# EAGLE schematic emoteino (EAGLE 8.2.1)
PROJECT_AUTHOR: TINKERMAN <xose.perez@gmail.com>; PROJECT_LICENSE: MIT; PROJECT_NAME: MOTEINO EMON SHIELD; PROJECT_VERSION: 0.2.20161214
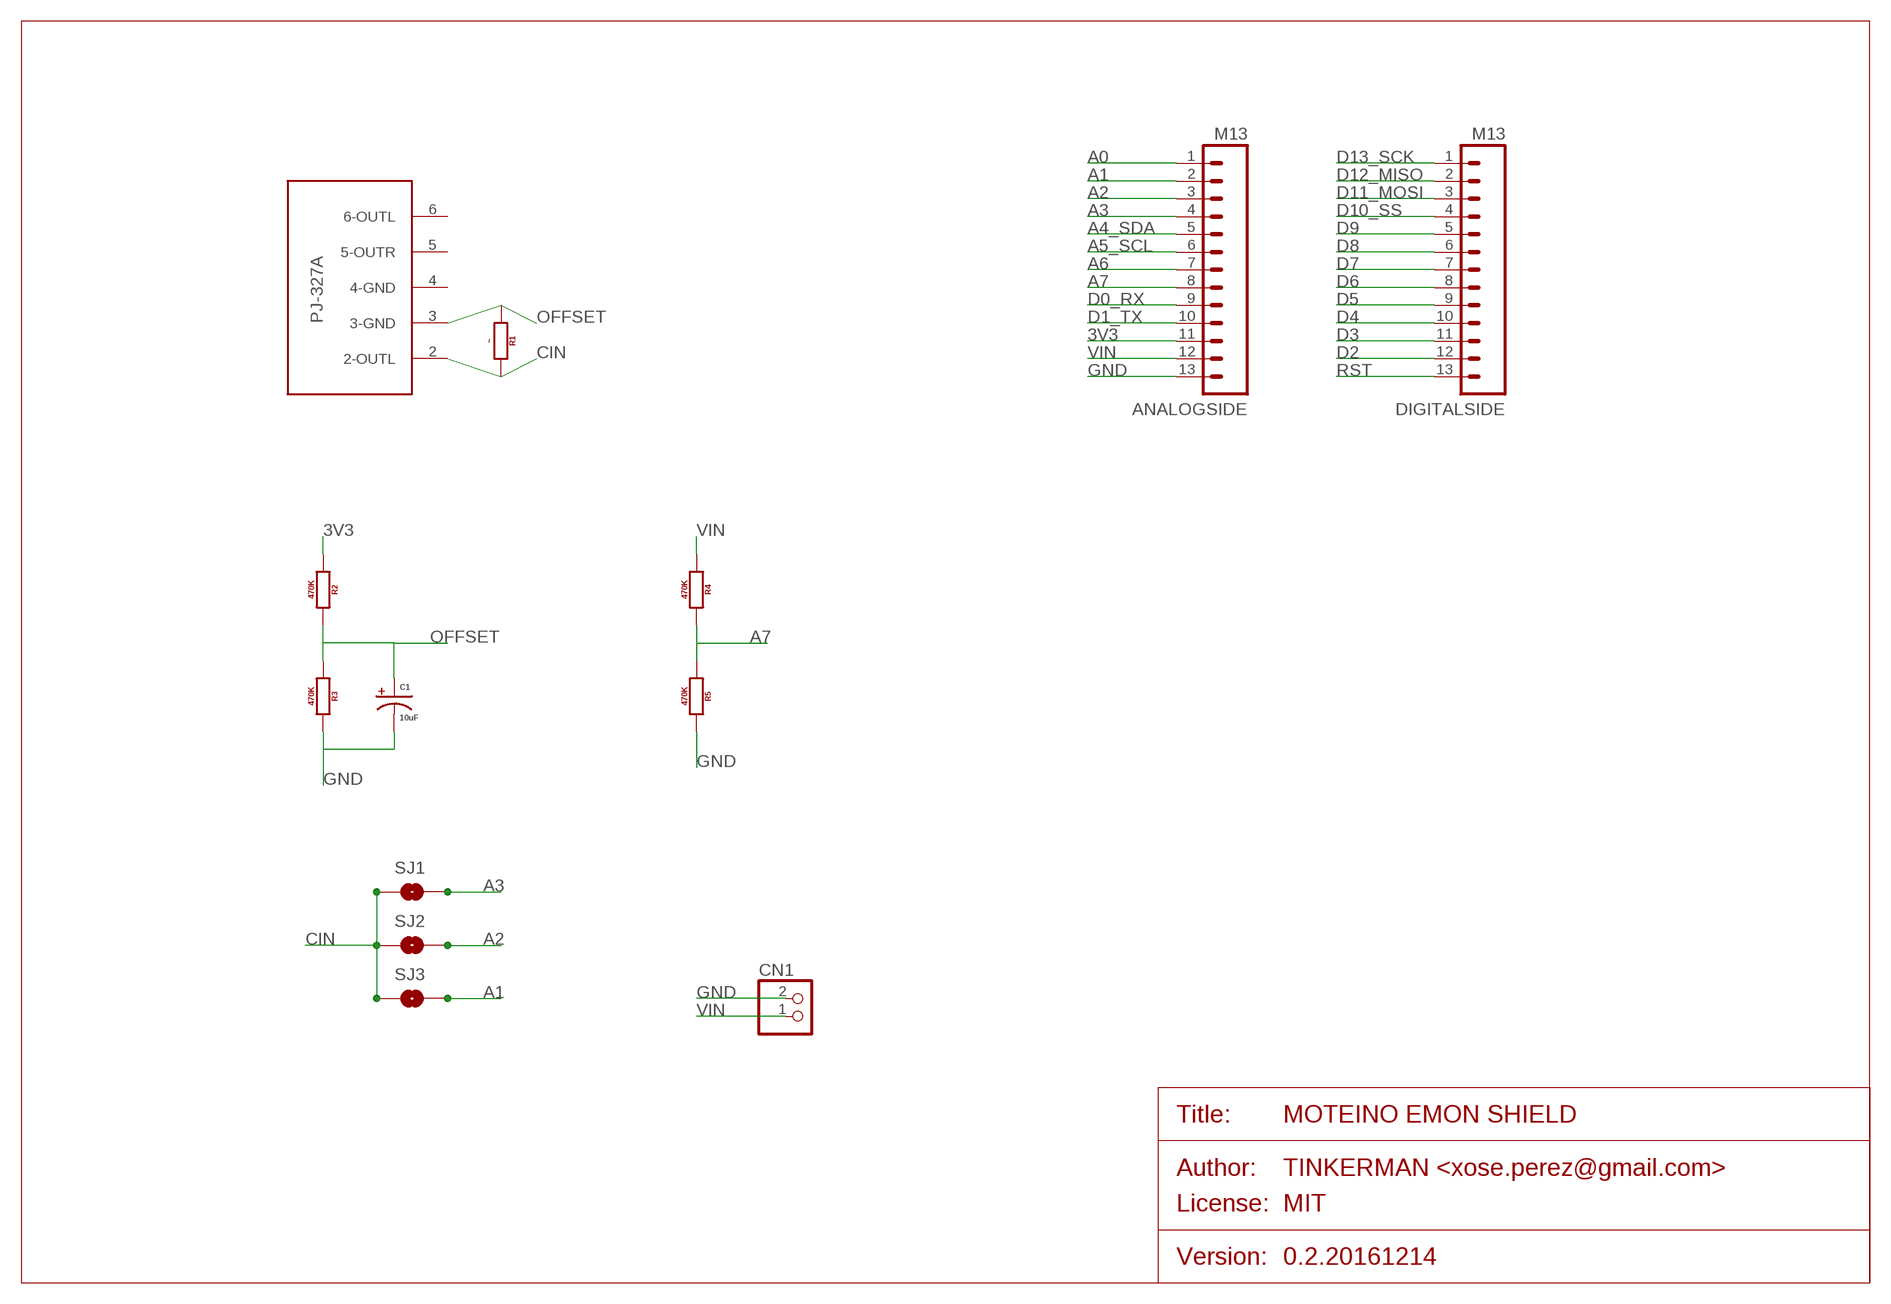
[diagram p0: schematic, sheet 1]

## Parts
ANALOGSIDE  M13  [1X13_NO_SILK]
C1  10uF  CAP_POLPTH2  [CPOL-RADIAL-10UF-25V]
CN1  JST_2PIN-SMT-RA  [JST-PH-2-SMT-RA]
CURR1  PJ-327A  [PJ-327A]
DIGITALSIDE  M13  [1X13_NO_SILK]
R1  ~  RESISTOR0805  [0805]
R2  470K  RESISTOR0805  [0805]
R3  470K  RESISTOR0805  [0805]
R4  470K  RESISTOR0805  [0805]
R5  470K  RESISTOR0805  [0805]
SJ1  SOLDERJUMPERNO  [SJ_2S-NO]
SJ2  SOLDERJUMPERNO  [SJ_2S-NO]
SJ3  SOLDERJUMPERNO  [SJ_2S-NO]

## Nets
3V3: ANALOGSIDE.11 R2.1
A0: ANALOGSIDE.1
A1: ANALOGSIDE.2 SJ3.2
A2: ANALOGSIDE.3 SJ2.2
A3: ANALOGSIDE.4 SJ1.2
A4_SDA: ANALOGSIDE.5
A5_SCL: ANALOGSIDE.6
A6: ANALOGSIDE.7
A7: ANALOGSIDE.8 R4.2 R5.1
CIN: CURR1.2(2-OUTL) R1.2 SJ1.1 SJ2.1 SJ3.1
D0_RX: ANALOGSIDE.9
D1_TX: ANALOGSIDE.10
D2: DIGITALSIDE.12
D3: DIGITALSIDE.11
D4: DIGITALSIDE.10
D5: DIGITALSIDE.9
D6: DIGITALSIDE.8
D7: DIGITALSIDE.7
D8: DIGITALSIDE.6
D9: DIGITALSIDE.5
D10_SS: DIGITALSIDE.4
D11_MOSI: DIGITALSIDE.3
D12_MISO: DIGITALSIDE.2
D13_SCK: DIGITALSIDE.1
GND [power]: ANALOGSIDE.13 C1.2(-) CN1.2 R3.2 R5.2
OFFSET: C1.1(+) CURR1.3(3-GND) R1.1 R2.2 R3.1
RST: DIGITALSIDE.13
VIN: ANALOGSIDE.12 CN1.1 R4.1
Unconnected: CURR1.4(4-GND) CURR1.5(5-OUTR) CURR1.6(6-OUTL)

## Library data of the parts
ANALOGSIDE DIGITALSIDE = xose:M13
C1 = xose:CAP_POL: Capacitor Polarized These are standard SMD and PTH capacitors. Normally 10uF, 47uF, and 100uF in electrolytic and tantalum varieties. Always verify the external diameter of the through hole cap, it varies with capacity, voltage, and manufacturer. The EIA devices should be standard.
CN1 = adafruit:JST_2PIN: JST 2-Pin Connectors of various flavors SMT-RA (S2B-PH-SM4) 4UConnector #17311 SMT (B2B-PH-SM4) THM-RA (S2B-PH) THM (B2B-PH)
CURR1 = PJ-327A:PJ-327A
R1-R5 = xose:RESISTOR: Generic EU resistor symbol
SJ1-SJ3 = xose:SOLDERJUMPER: Solder Jumper Standard SMD solder jumper. Used to automate production. Two varients : Normally Open and Normally Closed are the same, but have different paste layers. NC will have a large amount of paste and should jumper during reflow.

## Net classes
1 power: width 0.381 mm, clearance 0.254 mm